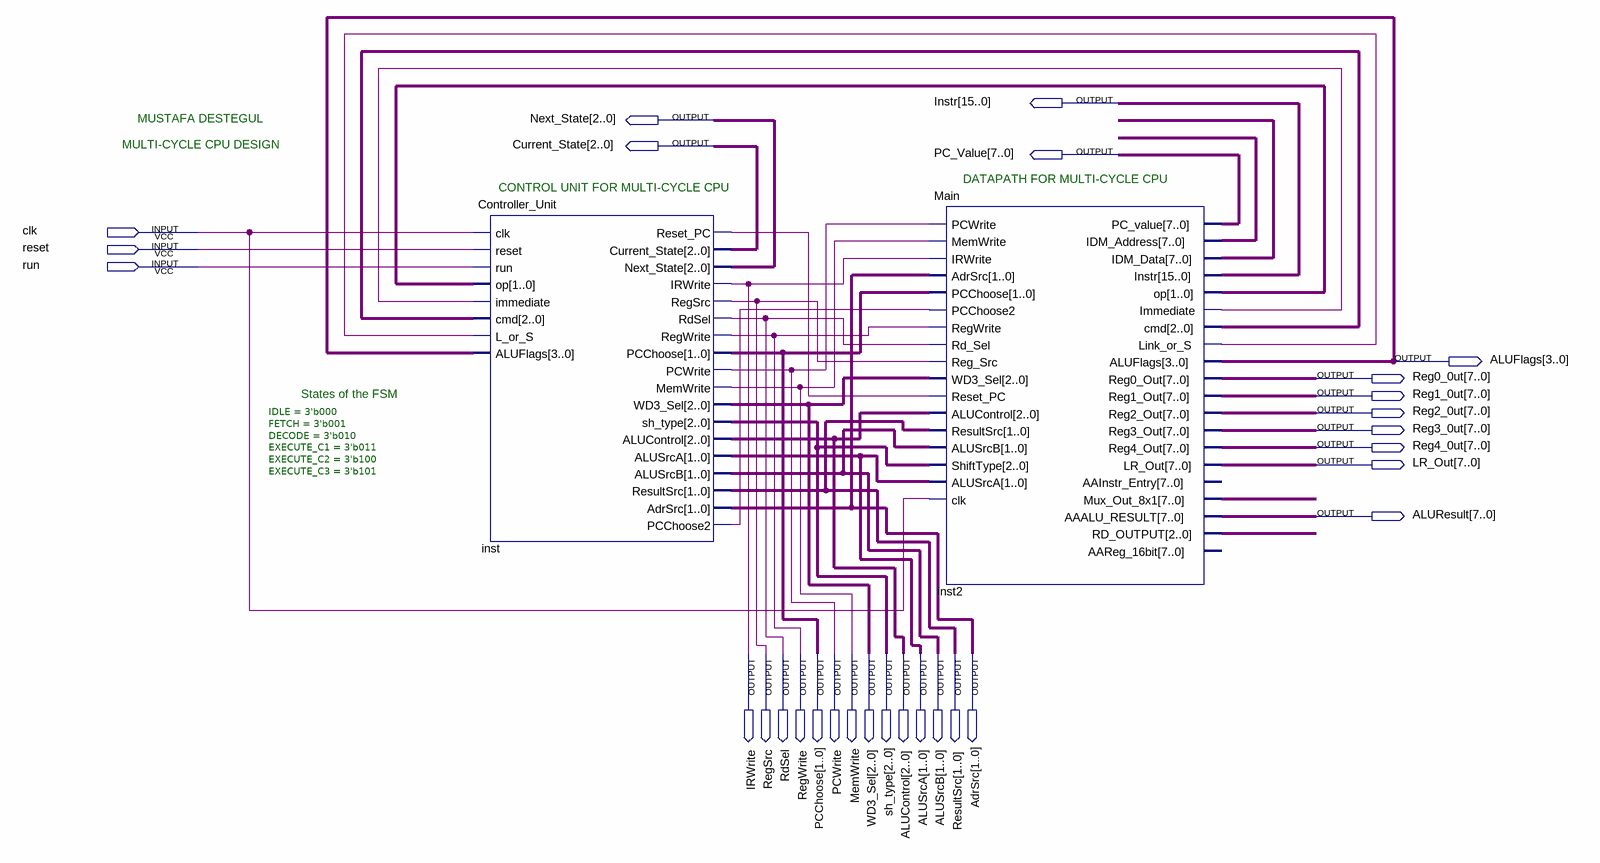
[diagram p0: schematic sheet]
// Quartus schematic Top_Module.bdf as structural Verilog: 2 symbols, 29 pins
module Top_Module (
  input  clk,
  input  reset,
  input  run,
  output [15:0] Instr,
  output [2:0] Next_State,
  output [2:0] Current_State,
  output [7:0] PC_Value,
  output [3:0] ALUFlags,
  output [7:0] Reg0_0ut,
  output [7:0] Reg1_0ut,
  output [7:0] Reg2_0ut,
  output [7:0] Reg3_0ut,
  output [7:0] Reg4_0ut,
  output [7:0] LR_Out,
  output [7:0] ALUResult,
  output IRWrite,
  output RegSrc,
  output RdSel,
  output RegWrite,
  output [1:0] PCChoose,
  output PCWrite,
  output MemWrite,
  output [2:0] WD3_Sel,
  output [2:0] sh_type,
  output [2:0] ALUControl,
  output [1:0] ALUSrcA,
  output [1:0] ALUSrcB,
  output [1:0] ResultSrc,
  output [1:0] AdrSrc
);

  wire inst2_immediate, inst2_link_or_s, inst_pcchoose2, inst_reset_pc;
  wire [1:0] inst2_op;
  wire [2:0] inst2_cmd, inst2_rd_output;
  wire [7:0] inst2_idm_address, inst2_idm_data, inst2_mux_out_8x1;

  Controller_Unit #(.IDLE(3'b000), .FETCH(3'b001), .DECODE(3'b010), .EXECUTE_C1(3'b011), .EXECUTE_C2(3'b100), .EXECUTE_C3(3'b101)) inst (
    .clk(clk), .reset(reset), .run(run), .op(inst2_op), .immediate(inst2_immediate), .cmd(inst2_cmd),
    .L_or_S(inst2_link_or_s), .ALUFlags(ALUFlags), .Reset_PC(inst_reset_pc), .Current_State(Current_State),
    .Next_State(Next_State), .IRWrite(IRWrite), .RegSrc(RegSrc), .RdSel(RdSel), .RegWrite(RegWrite),
    .PCChoose(PCChoose), .PCWrite(PCWrite), .MemWrite(MemWrite), .WD3_Sel(WD3_Sel), .sh_type(sh_type),
    .ALUControl(ALUControl), .ALUSrcA(ALUSrcA), .ALUSrcB(ALUSrcB), .ResultSrc(ResultSrc), .AdrSrc(AdrSrc),
    .PCChoose2(inst_pcchoose2));
  Main inst2 (
    .PCWrite(PCWrite), .MemWrite(MemWrite), .IRWrite(IRWrite), .AdrSrc(AdrSrc), .PCChoose(PCChoose),
    .PCChoose2(inst_pcchoose2), .RegWrite(RegWrite), .Rd_Sel(RdSel), .Reg_Src(RegSrc), .WD3_Sel(WD3_Sel),
    .Reset_PC(inst_reset_pc), .ALUControl(ALUControl), .ResultSrc(ResultSrc), .ALUSrcB(ALUSrcB),
    .ShiftType(sh_type), .ALUSrcA(ALUSrcA), .clk(clk), .PC_value(PC_Value), .IDM_Address(inst2_idm_address),
    .IDM_Data(inst2_idm_data), .Instr(Instr), .op(inst2_op), .Immediate(inst2_immediate), .cmd(inst2_cmd),
    .Link_or_S(inst2_link_or_s), .ALUFlags(ALUFlags), .Reg0_Out(Reg0_0ut), .Reg1_Out(Reg1_0ut),
    .Reg2_Out(Reg2_0ut), .Reg3_Out(Reg3_0ut), .Reg4_Out(Reg4_0ut), .LR_Out(LR_Out),
    .Mux_Out_8x1(inst2_mux_out_8x1), .AAALU_RESULT(ALUResult), .RD_OUTPUT(inst2_rd_output));  // open: AAInstr_Entry, AAReg_16bit

  // Notes on the sheet:
  //   MUSTAFA DESTEGUL
  //      MULTI-CYCLE CPU DESIGN
  //   DATAPATH FOR MULTI-CYCLE CPU
  //   CONTROL UNIT FOR MULTI-CYCLE CPU
  //   States of the FSM
endmodule
